# EAGLE design avip-mod v4 (EAGLE 9.6.2)
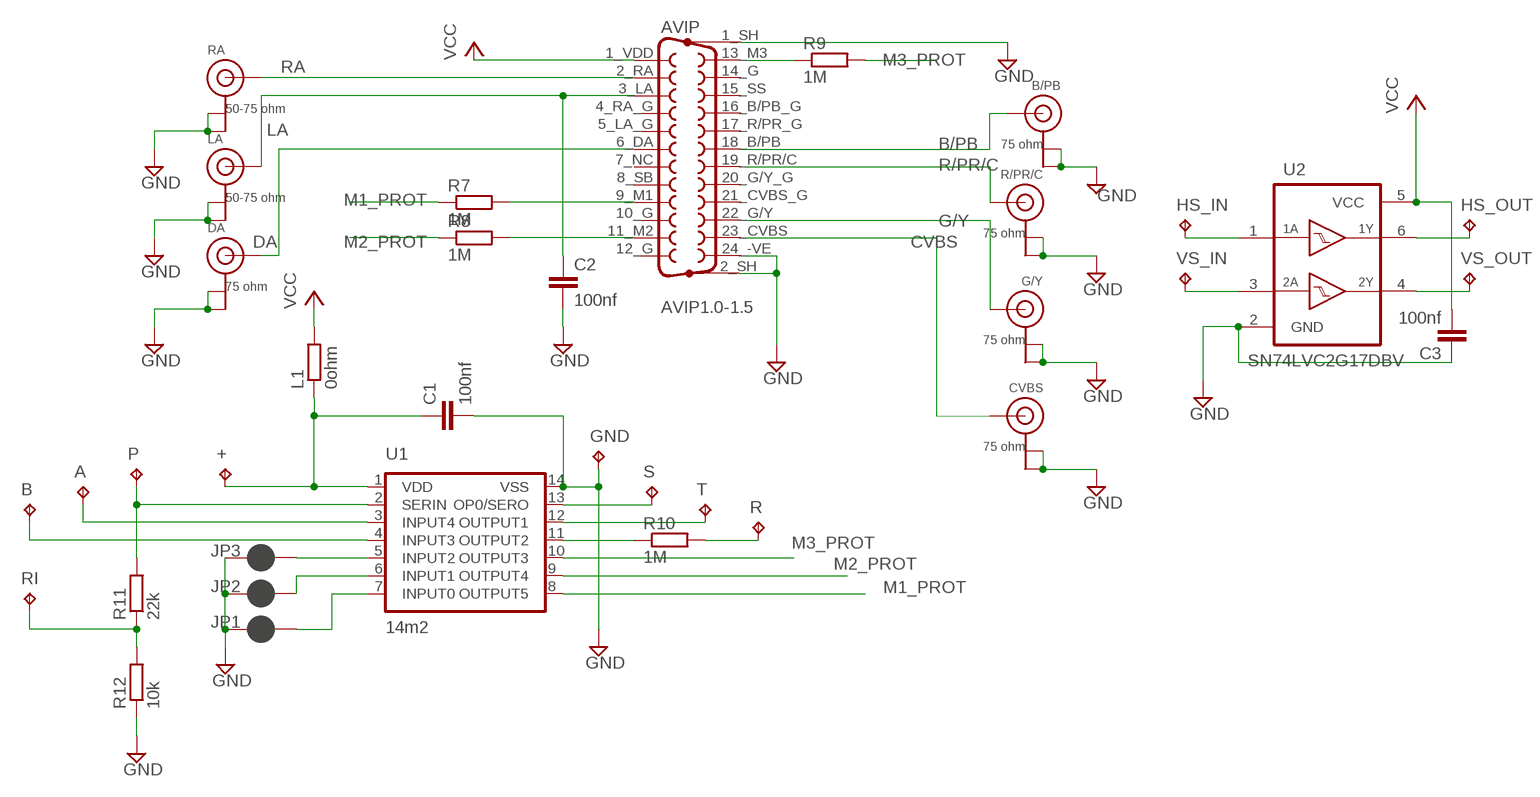
[diagram p0: schematic, sheet 1]

## Parts
+  TPTP07SQ  [TP07SQ]
A  TPTP07SQ  [TP07SQ]
AVIP  AVIP1.0-1.5  [AVIP-1.0-1.5]
B  TPTP07SQ  [TP07SQ]
B/PB  75 ohm  ANTENNA_U.FL  [U.FL]
C1  100nf  C-EUC0603  [C0603]
C2  100nf  C-EUC0603  [C0603]
C3  100nf  C-EUC0603  [C0603]
CVBS  75 ohm  ANTENNA_U.FL  [U.FL]
DA  75 ohm  ANTENNA_U.FL  [U.FL]
G/Y  75 ohm  ANTENNA_U.FL  [U.FL]
GND  TPTP07SQ  [TP07SQ]
HS_IN  TPTP07SQ  [TP07SQ]
HS_OUT  TPTP07SQ  [TP07SQ]
JP1  JUMPER-SMT_NO-SILK  [SMT-JUMPER]
JP2  JUMPER-SMT_NO-SILK  [SMT-JUMPER]
JP3  JUMPER-SMT_NO-SILK  [SMT-JUMPER]
L1  0ohm  R-EU_R0603  [R0603]
LA  50-75 ohm  ANTENNA_U.FL  [U.FL]
P  TPTP07SQ  [TP07SQ]
R  TPTP07SQ  [TP07SQ]
R7  1M  R-EU_R0603  [R0603]
R8  1M  R-EU_R0603  [R0603]
R9  1M  R-EU_R0603  [R0603]
R10  1M  R-EU_R0603  [R0603]
R11  22k  R-EU_R0603  [R0603]
R12  10k  R-EU_R0603  [R0603]
R/PR/C  75 ohm  ANTENNA_U.FL  [U.FL]
RA  50-75 ohm  ANTENNA_U.FL  [U.FL]
RI  TPTP07SQ  [TP07SQ]
S  TPTP07SQ  [TP07SQ]
T  TPTP07SQ  [TP07SQ]
U1  14m2  PICAXE-14AXE017M2SM  [SO14]
U2  SN74LVC2G17DBV  [SOT23-6]
VS_IN  TPTP07SQ  [TP07SQ]
VS_OUT  TPTP07SQ  [TP07SQ]

## Nets
A: A.TP U1.3(INPUT4)
B: B.TP U1.4(INPUT3)
B/PB [video length]: AVIP.18_B/PB B/PB.3(SIGNAL)
CVBS: AVIP.23_CVBS CVBS.3(SIGNAL)
DA: AVIP.6_DA DA.3(SIGNAL)
G/Y [video length]: AVIP.22_G/Y G/Y.3(SIGNAL)
GND: AVIP.1_SH AVIP.2_SH AVIP.24_-VE(25_VSS) B/PB.1(GND) B/PB.2(GND) C1.2 C2.2 C3.1 CVBS.1(GND) CVBS.2(GND) DA.1(GND) DA.2(GND) G/Y.1(GND) G/Y.2(GND) GND.TP JP1.1 JP2.1 JP3.1 LA.1(GND) LA.2(GND) R12.1 R/PR/C.1(GND) R/PR/C.2(GND) RA.1(GND) RA.2(GND) U1.14(VSS) U2.2(GND)
H_SYNC_IN: HS_IN.TP U2.1(1A)
H_SYNC_OUT [sync length]: HS_OUT.TP U2.6(1Y)
LA: AVIP.3_LA C2.1 LA.3(SIGNAL)
M1: AVIP.9_M1 R7.2
M1_PROT: R7.1 U1.8(OUTPUT5)
M1S: JP1.2 U1.7(INPUT0)
M2: AVIP.11_M2 R8.2
M2_PROT: R8.1 U1.9(OUTPUT4)
M2S: JP2.2 U1.6(INPUT1)
M3: AVIP.13_M3 R9.1
M3_PROT: R9.2 U1.10(OUTPUT3)
M3S: JP3.2 U1.5(INPUT2)
PROG: P.TP R11.2 U1.2(SERIN)
R/PR/C [video length]: AVIP.19_R/PR/C R/PR/C.3(SIGNAL)
RA: AVIP.2_RA RA.3(SIGNAL)
RESET: R10.2 R.TP
RESET_PROT: R10.1 U1.11(OUTPUT2)
RING: R11.1 R12.2 RI.TP
SPEAK: S.TP U1.13(OP0/SERO)
TOGGLE: T.TP U1.12(OUTPUT1)
V_SYNC_IN: U2.3(2A) VS_IN.TP
V_SYNC_OUT [sync length]: U2.4(2Y) VS_OUT.TP
VCC: AVIP.1_VDD C3.2 L1.2 U2.5(VCC)
VDD: +.TP C1.1 L1.1 U1.1(VDD)
Unconnected: AVIP.4_RA_G AVIP.5_LA_G AVIP.7_NC AVIP.8_SB AVIP.10_G AVIP.12_G AVIP.14_G AVIP.15_SS AVIP.16_B/PB_G AVIP.17_R/PR_G AVIP.20_G/Y_G AVIP.21_CVBS_G

## Library data of the parts
+ A B GND HS_IN HS_OUT P R RI S T VS_IN VS_OUT = testpad:TP: Test pad
AVIP = XBOX:AVIP
B/PB CVBS DA G/Y LA R/PR/C RA = XBOX:ANTENNA_U.FL: U.FL Antenna Connector
C1-C3 = rcl:C-EU: CAPACITOR, European symbol; SPICEPREFIX: C
JP1-JP3 = XBOX:JUMPER-SMT: Normally closed solder jumper This jumper has an aperture in the stencil to allow solder paste to bridge the split in the wire so it's normally closed (NC). Wick off the solder to open the connection. Reapply solder to reclose the connection.
L1 R7-R12 = rcl:R-EU_: RESISTOR, European symbol; SPICEPREFIX: R
U1 = XBOX:PICAXE-14
U2 = XBOX:SN74LVC2G17: DUAL SCHMITT-TRIGGER BUFFER

## Net classes
0 standard: width 0.25 mm, clearance 0.205 mm
1 video length: width 0.25 mm, clearance 0.205 mm to class 0, clearance 0.205 mm
2 sync length: width 0.25 mm, clearance 0.205 mm to class 0, clearance 0.205 mm to class 1, clearance 0.205 mm

## Board
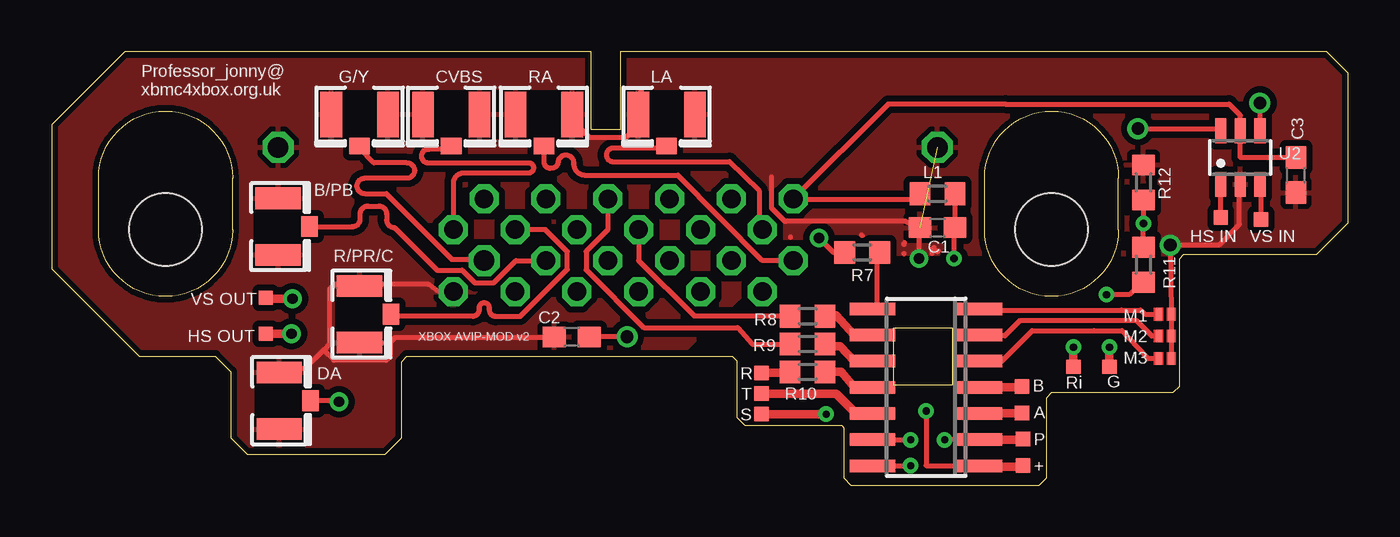
[diagram p1: board, top side]
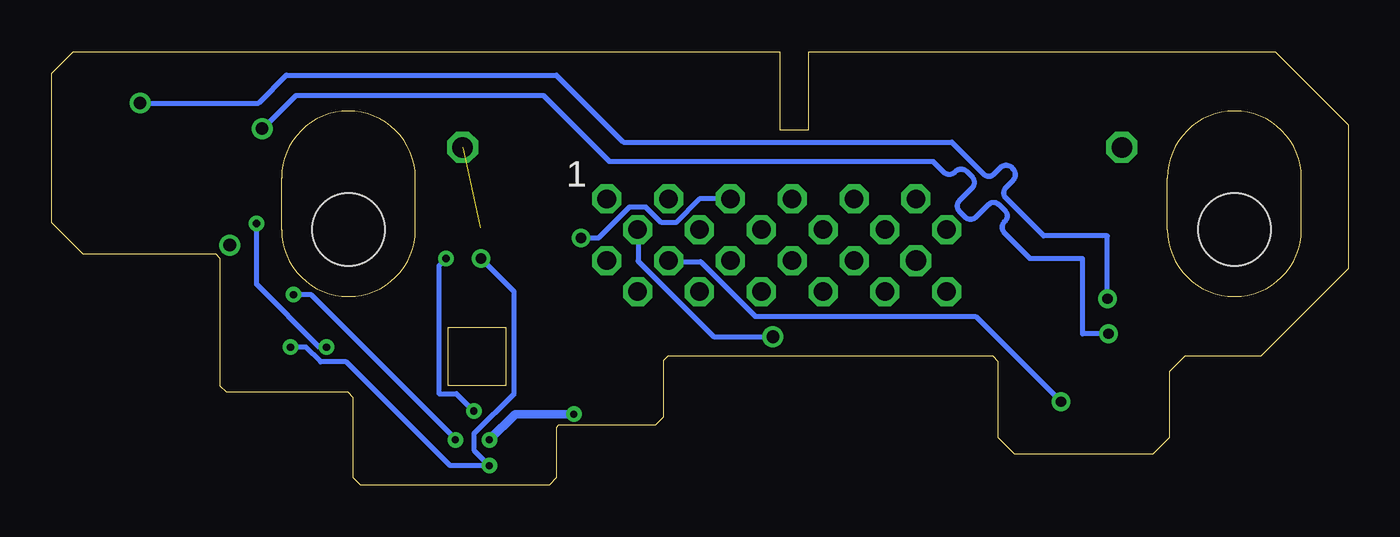
[diagram p2: board, bottom side, seen from below]

Size 62.95 x 21.05 mm. Coordinates in mm from the lower left corner, seen from the top.
Outline: 33.05,6.25 33.25,6.05 33.25,3.3 33.65,2.9 38.35,2.9 38.45,2.8 38.45,0.35 38.8,0 47.95,0 48.3,0.35 48.3,4.25 48.55,4.5 54.45,4.5 54.75,4.8 54.75,11 54.95,11.2 61.4,11.2 62.95,12.75 62.95,20 61.9,21.05 27.6,21.05 27.6,17.25 26.2,17.25 26.2,21.05 3.55,21.05 0,17.5 0,10.5 4.25,6.25 7.95,6.25 8.7,5.5 8.7,2.3 9.5,1.5 16.2,1.5 17,2.3 17,6 17.25,6.25 33.05,6.25
Copper layers (1*16): Top 0.035mm / dielectric 1.5mm / Bottom 0.035mm
Design rules "default *": minimum track width 6mil, minimum drill 0.35mm, track to track 6mil, track to pad 6mil, pad to pad 6mil, via to via 6mil, smd to smd 6mil, copper to edge 6mil, drill to drill 6mil, minimum pad ring 10mil, minimum via ring 8mil, stop-mask expansion 4mil, vias tented up to drill 15mm, thermal gap 10mil
Milling: 4 lines

### Footprints (pad centres in the part's own frame; a part is rotated, then mirrored left to right if it is on the bottom)
TP07SQ = smd 0.7 x 0.7: TP 0,0
AVIP-1.0-1.5 = drill 1 octagon: 1_SH -35.5,7; 2_SH -3.5,7; 22_G/Y -13.5,1.5 | drill 0.9 octagon: 1_VDD -28.5,4.5; 2_RA -28.5,1.5; 3_LA -27,3; 4_RA_G -27,0; 5_LA_G -25.5,4.5; 6_DA -25.5,1.5; 7_NC -24,3; 8_SB -24,0; 9_M1 -22.5,4.5; 10_G -22.5,1.5; 11_M2 -21,3; 12_G -21,0; 13_M3 -19.5,4.5; 14_G -19.5,1.5; 15_SS -18,3; 16_B/PB_G -18,0; 17_R/PR_G -16.5,4.5; 18_B/PB -16.5,1.5; 19_R/PR/C -15,3; 20_G/Y_G -15,0; 21_CVBS_G -13.5,4.5; 23_CVBS -12,3; 24_-VE -12,0 | hole 3.5: -41.035,3.01; 1.965,3.01
U.FL = smd 2.2 x 1.05: 1 0,1.375; 2 0,-1.375 | smd 0.8 x 1: 3 1.525,0
C0603 = smd 1.1 x 1: 1 -0.85,0; 2 0.85,0
SMT-JUMPER = smd 0.305 x 0.61: 1 0.3,0; 2 -0.312,0
R0603 = smd 1 x 1.1: 1 -0.85,0; 2 0.85,0
SO14 = smd 0.6 x 2.2: 1 -3.81,-2.6; 2 -2.54,-2.6; 3 -1.27,-2.6; 4 0,-2.6; 5 1.27,-2.6; 6 2.54,-2.6; 7 3.81,-2.6; 8 3.81,2.6; 9 2.54,2.6; 10 1.27,2.6; 11 0,2.6; 12 -1.27,2.6; 13 -2.54,2.6; 14 -3.81,2.6
SOT23-6 = smd 0.55 x 1.2: 1 -0.95,-1.3; 2 0,-1.3; 3 0.95,-1.3; 4 0.95,1.3; 5 0,1.3; 6 -0.95,1.3

### Placement (x,y rotation side)
+  47.15,0.95 0 top
A  47.1,3.5 0 top
AVIP  7.5,9.4 0 bottom
B  47.1,4.8 0 top
B/PB  11,12.55 0 top
C1  43,12.5 180 top
C2  25.25,7.2 180 top
C3  60.4,15.05 90 top
CVBS  19.4,18 270 top
DA  11.05,4.1 0 top
G/Y  14.95,18 270 top
GND  51.35,5.75 0 top
HS_IN  56.75,13 180 top
HS_OUT  10.4,7.35 180 top
JP1  54.05,8.3 0 top
JP2  54.05,7.25 0 top
JP3  54.05,6.15 0 top
L1  43,14.15 180 top
LA  29.85,18 270 top
P  47.15,2.25 0 top
R  34.45,5.45 0 top
R7  39.35,11.3 180 top
R8  36.7,8.2 180 top
R9  36.7,6.85 0 top
R10  36.7,5.5 180 top
R11  53,10.7 270 top
R12  53,14.7 270 top
R/PR/C  14.95,8.3 0 top
RA  23.9,18 270 top
RI  49.6,5.75 0 top
S  34.45,3.45 0 top
T  34.45,4.45 0 top
U1  42.45,4.75 90 top
U2  57.7,15.9 0 top
VS_IN  58.7,12.9 180 top
VS_OUT  10.4,9.1 180 top

### Tracks (layer width: path | path; a pad name or v marks a point on that pad's centre or on a via)
A
  Top 0.254: A.TP 47.1,3.53 47.05,3.5 | 45.3,3.5 45.15,3.53 U1.3
  Top 0.406: 45.3,3.5 47.05,3.5
B
  Top 0.254: B.TP 47.1,4.75 | 45.15,4.75 45.15,4.8 U1.4
  Top 0.406: U1.4 45.15,4.75 47.1,4.75
B/PB
  Top 0.25: 18.7,10.45 18.72,10.43 19.93,10.43 20.55,9.82 21.45,9.82 22.54,10.9 AVIP.18_B/PB | B/PB.3 14.6,12.55
  Top 0.254: 18.7,10.45 16.65,12.5 arc-90 16.27,12.88 16.27,13.17 arc90 15.88,13.55 15.36,13.55 arc90 14.98,13.17 14.98,12.93 arc-90 14.6,12.55
CVBS
  Top 0.254: AVIP.23_CVBS 19.5,14.65 arc-90 20,15.15 23.15,15.15 arc180 23.15,15.65 18.25,15.65 arc-180 18.32,16.3 19.45,16.3 19.45,16.39 CVBS.3
DA  (via drill 0.5)
  Top 0.254: v13.95,4.05 13.9,4.1 DA.3
  Bottom 0.254: v13.95,4.05 18.1,8.2 28.8,8.2 31.45,10.85 32.92,10.85 32.99,10.88 AVIP.6_DA
G/Y
  Top 0.254: AVIP.22_G/Y 20.95,10.95 19.45,10.95 16.25,14.15 15.2,14.15 arc-180 15.2,14.9 17.25,14.9 arc180 17.25,15.65 15.65,15.65 14.95,16.35 14.98,16.39 G/Y.3
GND  (via drill 0.35, 0.5, 0.61)  (1 unrouted)
  Top 0.25: 42.82,11.54 42.74,11.45 | U1.14 v41.7,0.95 | 56.65,11.65 v54.3,11.65 JP1.1 JP2.1 JP3.1
  Top 0.254: 34.95,14.95 34.95,13.45 35.61,12.79 35.74,12.83 41.42,12.83 C1.2 42.1,12.51 v42.1,11 42.3,11.2 42.28,11.25 | AVIP.24_-VE 18.8,9.4 18.3,9.75 13.75,9.75 13.48,9.48 13.48,6.83 13.21,6.56 | 15.8,6.85 15.85,6.9 16.45,6.9 16.45,6.27 16.24,6.06 13.71,6.06 13.21,6.56 | 13.21,6.56 12.3,5.65 11,5.65 | 28.63,19.14 28.6,19.14 | 31.61,17.99 LA.1 | 31.15,17.08 LA.1 | 31.38,18.11 LA.1 | 25.28,17.48 RA.1 25.28,17.7 25.67,17.3 25.67,17.31 26.1,16.89 27.89,16.89 28.2,17.2 28.17,17.3 28.17,17.76 28.4,17.99 LA.2 | 42.86,11.48 42.74,11.45 42.74,11.25 | 42.97,11.34 43.04,11.36 | 24.61,7.15 16.65,7.15 16.43,6.92 | 56.65,11.65 57.65,12.66 57.65,14.55 U2.2 | 39.3,12.14 39.35,12.11 | 41.37,11.68 41.4,11.78 | 41.37,11.22 41.37,11.25 | 42.13,11.23 42.05,11.25 | 35.86,12.03 35.86,12.04 | CVBS.2 18.05,18 18.07,17.99 CVBS.2
  Top 0.406: v51.35,6.7 GND.TP
  Bottom 0.25: 40.5,9.4 v42.1,11 | v41.7,0.95 43.6,0.95 48.64,5.99 49.89,5.99 50.6,6.7 v51.35,6.7
  Bottom 0.254: 40.5,9.4 40.5,4.45 42.45,2.5 42.45,1.7 v41.7,0.95
  pour Top (isolate 0.305): 0,17.5 0,10.5 4.23,6.25 7.93,6.23 8.7,5.5 8.74,2.29 9.5,1.52 16.26,1.52 17,2.32 17.01,5.98 17.29,6.25 30.37,6.26 35.56,11.26 61.4,11.2 62.95,12.8 62.95,19.95 61.95,21.05 27.6,21.05 27.6,17.25 26.2,17.25 26.2,21.05 3.55,21
H_SYNC_IN
  Top 0.25: HS_IN.TP U2.1
H_SYNC_OUT  (via drill 0.5 pad 0.25, 0.61)
  Top 0.254: v52.73,17.3 56.74,17.3 U2.6
  Top 0.406: v11.65,7.35 HS_OUT.TP
  Bottom 0.254: v52.73,17.3 52.7,17.3 51.08,18.92 39.08,18.92 35.86,15.7 20.15,15.7 19.65,15.2 arc-90 19.11,15.2 19.07,15.23 arc90 18.54,15.23 18.27,14.97 arc90 18.27,14.43 18.88,13.82 arc-90 18.88,13.28 18.62,13.02 arc-90 18.08,13.02 17.47,13.63 arc90 16.98,13.63 16.66,13.31 arc90 16.66,12.82 16.7,12.79 arc-90 16.7,12.25 15.45,11 12.9,11 12.9,7.35 v11.65,7.35
LA  (via drill 0.61)
  Top 0.254: AVIP.3_LA 34.35,12.55 34.35,14.29 32.9,15.7 27.2,15.7 arc-143 27.15,16.35 29.74,16.35 29.78,16.5 LA.3 | v27.94,7.21 C2.1
  Bottom 0.254: v27.94,7.21 30.81,7.21 34.48,10.88 34.48,12.37 AVIP.3_LA
M1  (via drill 0.5)
  Top 0.254: v37.25,12 37.95,11.3 R7.2 | R7.2 38.5,11.34 R7.2
  Bottom 0.254: v37.25,12 36.4,12 34.9,13.5 34.1,13.5 33.35,12.75 32.65,12.75 31.5,13.9 AVIP.9_M1 30.01,13.86 AVIP.9_M1
M1_PROT
  Top 0.254: R7.1 40.1,11.34 40.05,11.34 40.05,8.58 39.99,8.58 U1.8
M1S
  Top 0.25: 51.93,8.5 52.85,8.5 53.05,8.3 JP1.2
  Top 0.254: 51.93,8.5 45.2,8.5 45.15,8.47 U1.7
M2
  Top 0.254: AVIP.11_M2 28.5,10.9 31.19,8.21 35.79,8.21 35.98,8.29 R8.2
M2_PROT
  Top 0.254: U1.9 38.97,7.28 | 37.51,8.25 R8.1
  Top 0.406: 38.97,7.28 38.09,8.25 37.51,8.25
M2S
  Top 0.25: 50.75,8 52.65,8 53.4,7.25 JP2.2
  Top 0.254: 50.75,8 47.02,8 46.27,7.25 45.6,7.25 45.5,7.32 45.15,7.32 U1.6
M3
  Top 0.254: AVIP.13_M3 27,12.4 25.95,11.35 25.95,10.45 28.75,7.65 33.3,7.65 34.01,6.85 R9.1
M3_PROT
  Top 0.254: 38.97,6.02 39.07,6.06 39.76,6.06 U1.10 | R9.2 37.58,6.91 37.58,6.75
  Top 0.406: 38.97,6.02 38.29,6.75 37.58,6.75
M3S
  Top 0.25: 50.6,7.5 51.95,7.5 53.1,6.25 53.2,6.15 JP3.2
  Top 0.254: 50.6,7.5 47.6,7.5 46.12,6.02 46.07,6.06 45.73,6.06 | 45.73,6.06 45.15,6.06 U1.5 45.73,6.06
PROG  (via drill 0.35)
  Top 0.25: U1.2 v43.35,2.2
  Top 0.254: v51.2,9.25 52.3,9.25 52.8,9.75 52.89,9.95 R11.2 | 45.15,2.2 45.15,2.27 U1.2 | P.TP 47.22,2.27 47.15,2.2
  Top 0.406: 45.15,2.2 47.15,2.2
  Bottom 0.254: v43.35,2.2 43.35,2.25 50.35,9.25 v51.2,9.25
R/PR/C
  Top 0.25: 21.55,8.2 22.76,8.2 25.03,10.47 25.03,11.33 23.97,12.4 AVIP.19_R/PR/C
  Top 0.254: 21.55,8.2 arc-90 21.25,8.5 21.25,8.6 arc90 21,8.85 arc90 20.75,8.6 20.75,8.54 arc-91 20.45,8.2 16.57,8.2 R/PR/C.3
RA
  Top 0.254: AVIP.2_RA 34.5,10.9 30.4,15.05 25.85,15.05 arc-90 25.35,15.63 arc90 24.96,16.02 arc90 24.59,15.65 arc-90 24.25,15.4 arc-90 23.9,15.63 23.9,16.4 23.93,16.5 RA.3
RESET
  Top 0.254: R.TP 34.48,5.49 34.6,5.45 | 35.74,5.45 35.74,5.49 R10.2
  Top 0.406: 35.74,5.45 34.6,5.45
RESET_PROT
  Top 0.254: 39,4.74 39.07,4.8 39.76,4.8 U1.11 | R10.1 37.58,5.6 37.58,5.5
  Top 0.406: 37.58,5.5 38.34,5.5 39,4.74
RING  (via drill 0.35)
  Top 0.25: R12.2 v53,12.7 R11.1
  Top 0.254: RI.TP 49.61,5.77 49.6,5.77
  Top 0.406: v49.6,6.7 49.6,5.77
  Bottom 0.254: v49.6,6.7 49.95,6.7 53,9.75 v53,12.7
SPEAK  (via drill 0.35)
  Top 0.25: U1.13 v41.69,2.21 v41.7,2.2
  Top 0.406: v37.6,3.45 S.TP
  Bottom 0.406: v41.7,2.2 40.45,3.45 v37.6,3.45
TOGGLE
  Top 0.254: 38.99,3.53 39.76,3.53 U1.12 | 34.45,4.44 T.TP
  Top 0.406: 34.45,4.44 38.08,4.44 38.99,3.53
V_SYNC_IN
  Top 0.254: VS_IN.TP 58.69,12.91 58.69,14.55 U2.3
V_SYNC_OUT  (via drill 0.5 pad 0.25, 0.61)
  Top 0.254: v58.65,18.55 U2.4
  Top 0.406: v11.7,9.05 10.45,9.05 VS_OUT.TP
  Bottom 0.254: v11.7,9.05 11.7,12.1 14.8,12.1 16.62,13.92 arc90 16.62,14.46 16.29,14.78 arc-90 16.29,15.37 16.32,15.4 arc-90 16.91,15.4 17.24,15.08 arc90 17.68,15.08 19.25,16.65 35.2,16.65 38.45,19.9 51.55,19.9 52.9,18.55 v58.65,18.55 | v58.65,18.55
VCC
  Top 0.25: 57.15,18.5 57.7,17.95 U2.5 57.7,15.9 | 46.3,18.5 40.6,18.5 AVIP.1_VDD
  Top 0.254: C3.2 57.7,15.9 | 46.3,18.5 57.15,18.5 | AVIP.1_VDD 36.09,13.86 41.84,13.86 L1.2
VDD  (via drill 0.35)
  Top 0.254: L1.1 C1.1 43.8,12.45 v43.8,11 | v42.45,3.6 42.45,0.95 45,0.95 45.04,1.01 U1.1 45.15,1.01 45.15,0.9 | +.TP 47.22,1.01 47.2,0.9
  Top 0.406: 45.15,0.9 47.2,0.9
  Bottom 0.254: v43.8,11 44.15,10.65 44.15,4.45 43.3,4.45 v42.45,3.6

### Text on the board
tNames: Professor_jonny@ / xbmc4xbox.org.uk | HS IN | VS IN | VS OUT | M1 | HS OUT | XBOX AVIP-MOD v2 | M2 | M3 | R | Ri | G | T | B | S | A | P | +